# Altium schematic sheet ADCIN_ACcoupled_ETC1-1-13.SchDoc
size A3
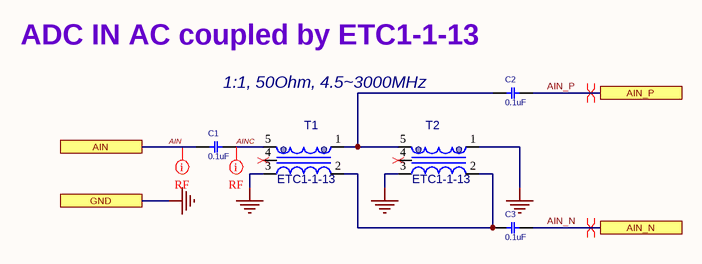
[diagram p0: ADCIN_ACcoupled_ETC1-1-13.SchDoc]

## Parts
C1  0.1uF  [C0402]
C2  0.1uF  [C0402]
C3  0.1uF  [C0402]
T1  ETC1-1-13  [TRNS_ETC1_1_13]
T2  ETC1-1-13  [TRNS_ETC1_1_13]

## Ports
AIN, AIN_N, AIN_P, GND

## Nets
GND: T1.3(SEC) T2.1(PRI.) T2.3(SEC) ; port GND
AIN: C1.1 ; port AIN
AIN_N: C3.2 ; port AIN_N
AIN_P: C2.2 ; port AIN_P
AINC: C1.2 T1.5(SEC.)
NetC2_1: C2.1 T1.1(PRI.) T2.5(SEC.)
NetC3_1: C3.1 T1.2(PRI) T2.2(PRI)

Not connected (* = marked no-connect by the designer): T1 4; T2 4

## Layout directives
net class RF: AIN, AINC
differential pair: AIN_N, AIN_P

## Notes on the sheet
- ADC IN AC coupled by ETC1-1-13
- 1:1, 50Ohm, 4.5~3000MHz
- Title
- Size:
- Date:
- A3
- Number:
- Time:
- Revision:
- Sheet
- of
- File:

## Library data of the parts
C1-C3 = CAP_SMD_MLCC_100n50TDK: CAP, MLCC, 100nF, 50V, X7R, 10%, 0402C; PARAM: X7R, 10%, -55~125oC; MANF_P#: GCM155R71H104KE02D; MANF: Murata; PARAM2: 50V; ASSEMBLY: ASSEMBLY; PRICE: 100= 4$; VALUE: 0.1uF
T1 T2 = ETC1-1-13: RF Transformer, 1:1, 50Ohm, 4.5~3000MHz; MANF: MACOM; DESC: DESCRIPTION; PARAM2: 0.25W, 30mA; ASSEMBLY: ASSEMBLY; PARAM: 1:1, 50Ohm, 4.5~3000MHz; PRICE: PRICE; MANF_P#: ETC1-1-13; VALUE: ETC1-1-13